# EAGLE design rs232-npn-pnp-negative-mirrored-alt (EAGLE 7.6.0)
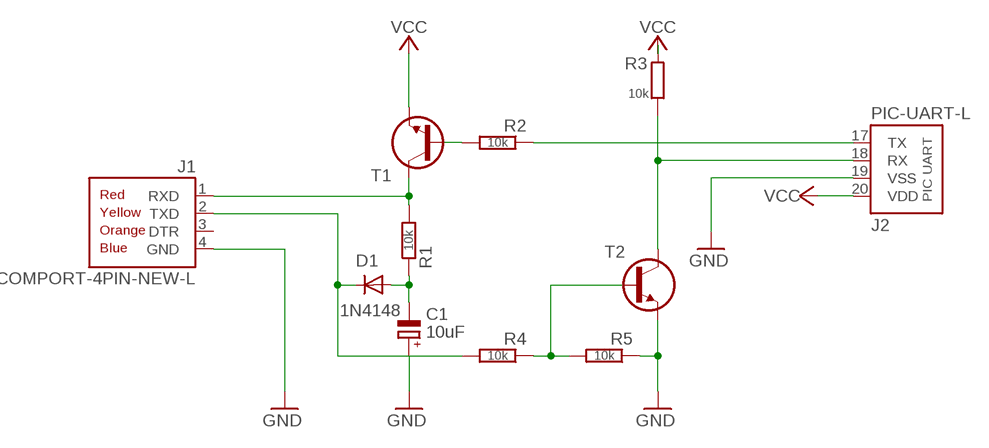
[diagram p0: schematic, sheet 1]

## Parts
C1  10uF  CPOLE2.5-5  [E2,5-5]
D1  1N4148  1N414834-5V  [DO34-5V]
J1  COMPORT-4PIN-NEW-L  [RS232-4PIN-NEW-L]
J2  PIC-UART-L  [PIC-UART-L]
R1  10k  R0202/7  [0202/7]
R2  10k  R0202/7  [0202/7]
R3  10k  R0202/7-V  [0202/7-V]
R4  10k  R0202/7  [0202/7]
R5  10k  R0202/7-V  [0202/7-V]
T1  BC547  BC547CBE  [TO92-CBE]
T2  BC547  BC547CBE  [TO92-CBE]

## Nets
-12V: C1.- D1.A R1.1
GND: C1.+ J1.4(GND) J2.19(VSS) R5.1 T2.E
N$1: R2.2 T1.B
N$6: R4.1 R5.2 T2.B
RX: J2.18(RX) R3.1 T2.C
RXD: J1.1(RXD) R1.2 T1.C
TX: J2.17(TX) R2.1
TXD: D1.C J1.2(TXD) R4.2
VCC: J2.20(VDD) R3.2 T1.E
Unconnected: J1.3(DTR)

## Library data of the parts
C1 = c:CPOL: POLARIZED CAPACITOR, European symbol
D1 = d:1N4148
J1 = pinconn:COMPORT-4PIN-NEW
J2 = pinconn:PIC-UART
R1-R5 = r:R: RESISTOR, European symbol
T1 T2 = t:BC547

## Net classes
0 default: width 0.61 mm

## Board
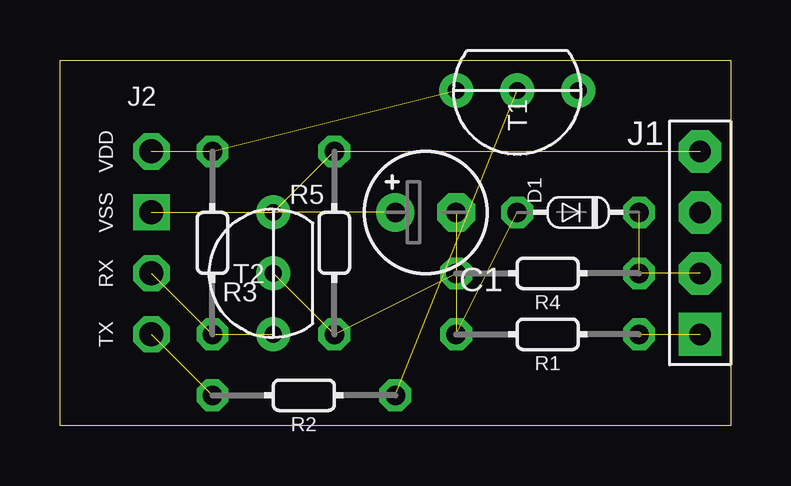
[diagram p1: board, top side]
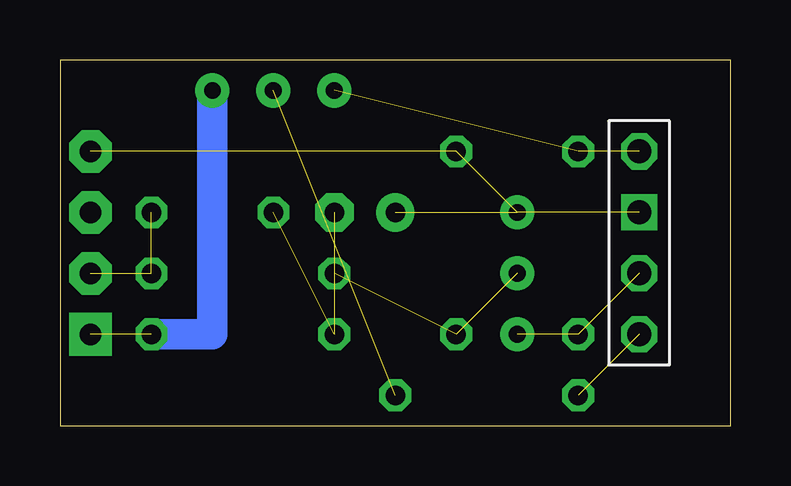
[diagram p2: board, bottom side, seen from below]

Size 27.94 x 15.24 mm. Coordinates in mm from the lower left corner, seen from the top.
Outline: 27.94,0 0,0 0,15.24 27.94,15.24 27.94,0
Copper layers (1*16): Top 0.035mm / dielectric 1.5mm / Bottom 0.035mm
Design rules "default": minimum track width 10mil, minimum drill 24mil, track to track 8mil, track to pad 8mil, pad to pad 8mil, via to via 8mil, smd to smd 8mil, copper to edge 40mil, drill to drill 8mil, minimum pad ring 10mil, minimum via ring 8mil, stop-mask expansion 4mil, vias tented up to drill 0mil, thermal gap 10mil

### Footprints (pad centres in the part's own frame; a part is rotated, then mirrored left to right if it is on the bottom)
E2,5-5 = drill 0.813 pad 1.6: + 1.27,0 | drill 0.813 pad 1.6 octagon: - -1.27,0
DO34-5V = drill 0.813 octagon: A 0,2.54; C 0,-2.54
RS232-4PIN-NEW-L = drill 0.9 pad 1.778 square: 1 0,-3.81 | drill 0.9 pad 1.778 octagon: 2 0,-1.27; 3 0,1.27; 4 0,3.81
PIC-UART-L = drill 1 octagon: 17 0,-3.81; 18 0,-1.27; 20 0,3.81 | drill 1 square: 19 0,1.27
0202/7 = drill 0.813 octagon: 1 -3.81,0; 2 3.81,0
0202/7-V = drill 0.813 octagon: 1 0,-3.81; 2 0,3.81
TO92-CBE = drill 0.7 pad 1.422: B 0,0; C 0,2.54; E 0,-2.54

### Placement (x,y rotation side)
C1  15.24,8.89 180 top
D1  21.59,8.89 90 top
J1  26.67,7.62 0 top
J2  3.81,7.62 0 top
R1  20.32,3.81 0 top
R2  10.16,1.27 0 top
R3  6.35,7.62 0 top
R4  20.32,6.35 0 top
R5  11.43,7.62 180 top
T1  19.05,13.97 270 top
T2  8.89,6.35 180 top

### Tracks (layer width: path | path; a pad name or v marks a point on that pad's centre or on a via)
-12V  (2 unrouted)
GND  (4 unrouted)
N$1  (1 unrouted)
N$6  (2 unrouted)
RX  (2 unrouted)
RXD  (1 unrouted)
  Bottom 1.27: T1.C 21.59,3.81 R1.2
TX  (1 unrouted)
TXD  (2 unrouted)
VCC  (2 unrouted)